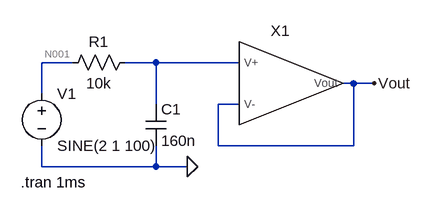
[diagram p0: schematic FirstOrder2.asc]
FirstOrder2.asc, the LTspice schematic file:
Version 4
SHEET 1 880 680
WIRE -48 -80 -96 -80
WIRE 80 -80 32 -80
WIRE 208 -80 80 -80
WIRE 384 -48 368 -48
WIRE 416 -48 384 -48
WIRE -96 -32 -96 -80
WIRE 80 -16 80 -80
WIRE 208 -16 176 -16
WIRE 176 48 176 -16
WIRE 384 48 384 -48
WIRE 384 48 176 48
WIRE -96 80 -96 48
WIRE 80 80 80 48
WIRE 80 80 -96 80
WIRE 128 80 80 80
FLAG 128 80 0
FLAG 416 -48 Vout
SYMBOL res 48 -96 R90
WINDOW 0 0 56 VBottom 2
WINDOW 3 32 56 VTop 2
SYMATTR InstName R1
SYMATTR Value 10k
SYMBOL cap 64 -16 R0
SYMATTR InstName C1
SYMATTR Value 160n
SYMBOL MY_IDEAL_opamp 272 -48 R0
SYMATTR InstName X1
SYMBOL voltage -96 -48 R0
WINDOW 123 0 0 Left 0
WINDOW 39 0 0 Left 0
SYMATTR InstName V1
SYMATTR Value SINE(2 1 100)
TEXT -128 104 Left 2 !.tran 1ms

The netlist it stands for:
* FirstOrder2.asc
R1 N002 N001 10k
C1 N002 0 160n
XX1 N002 Vout Vout MY_IDEAL_opamp  ; pins V+ V- Vout
V1 N001 0 SINE(2 1 100)
.tran 1ms
.backanno
.end

* Results of the author's LTspice run, read from the files saved beside the schematic
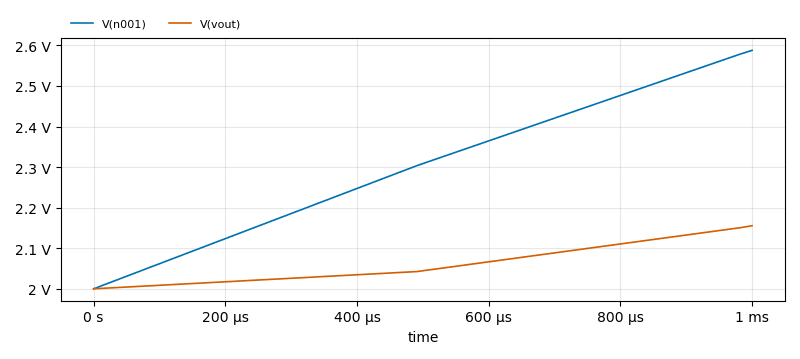
[diagram p1: Transient Analysis of FirstOrder2.asc, plotted from the saved traces]
* Transient Analysis, 1 run:
*   V(n001): min 2 V, max 2.588 V, average 2.302 V, rms 2.311 V, last 2.588 V
*   V(vout): min 2 V, max 2.155 V, average 2.061 V, rms 2.061 V, last 2.155 V